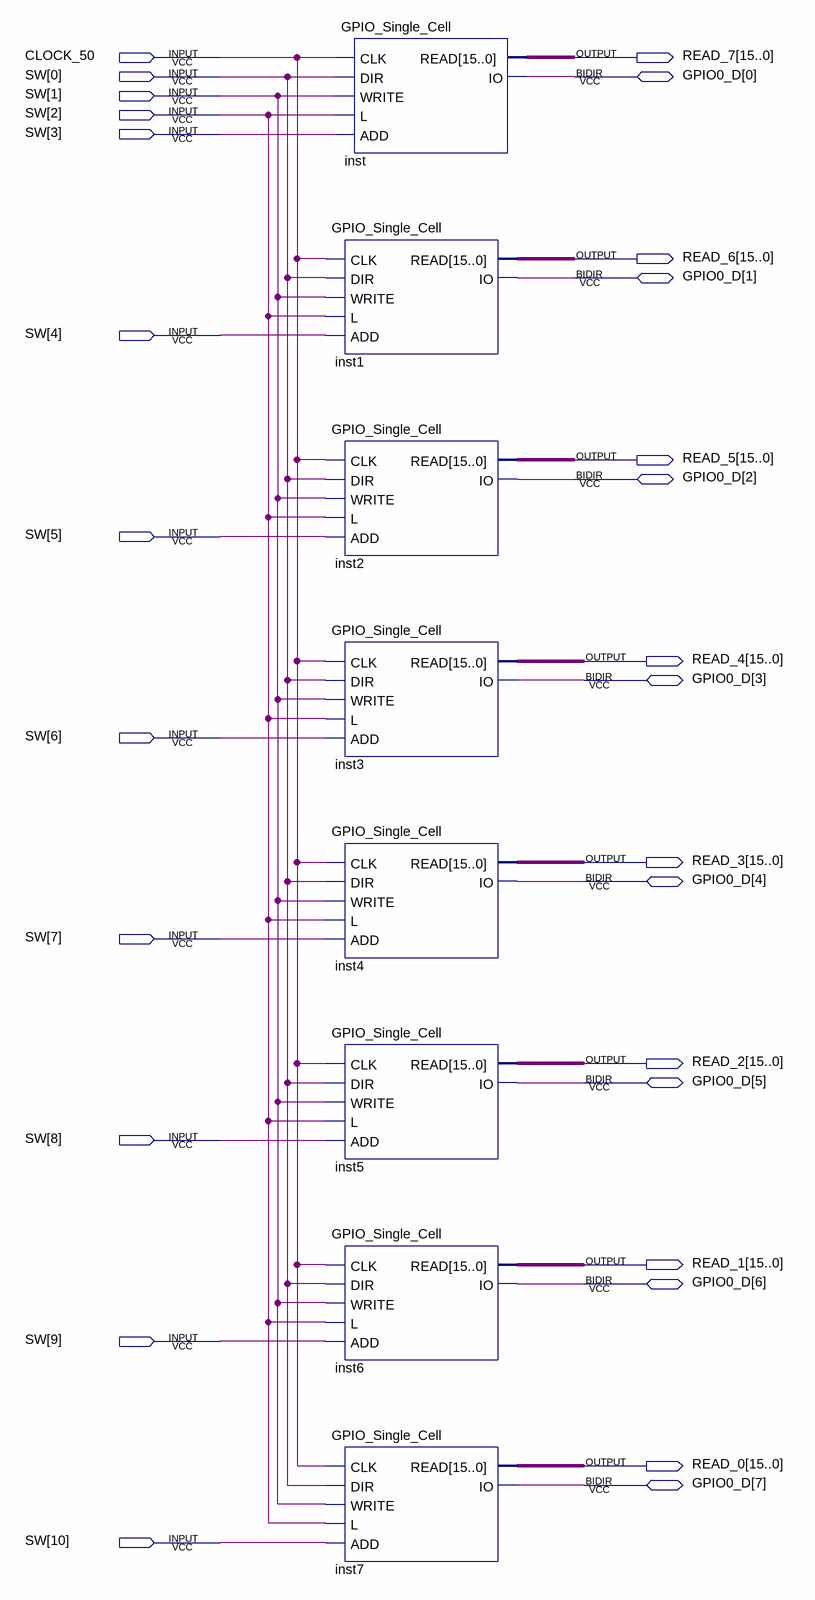
[diagram p0: schematic sheet]
// Quartus schematic GPIO_A_TEST.bdf as structural Verilog: 8 symbols, 28 pins
module GPIO_A_TEST (
  input  CLOCK_50,
  input  [10:0] SW,
  inout  [7:0] GPIO0_D,
  output [15:0] READ_7,
  output [15:0] READ_6,
  output [15:0] READ_5,
  output [15:0] READ_4,
  output [15:0] READ_3,
  output [15:0] READ_2,
  output [15:0] READ_1,
  output [15:0] READ_0
);

  GPIO_Single_Cell inst (
    .CLK(CLOCK_50), .DIR(SW[0]), .WRITE(SW[1]), .L(SW[2]), .ADD(SW[3]), .READ(READ_7), .IO(GPIO0_D[0]));
  GPIO_Single_Cell inst1 (
    .CLK(CLOCK_50), .DIR(SW[0]), .WRITE(SW[1]), .L(SW[2]), .ADD(SW[4]), .READ(READ_6), .IO(GPIO0_D[1]));
  GPIO_Single_Cell inst2 (
    .CLK(CLOCK_50), .DIR(SW[0]), .WRITE(SW[1]), .L(SW[2]), .ADD(SW[5]), .READ(READ_5), .IO(GPIO0_D[2]));
  GPIO_Single_Cell inst3 (
    .CLK(CLOCK_50), .DIR(SW[0]), .WRITE(SW[1]), .L(SW[2]), .ADD(SW[6]), .READ(READ_4), .IO(GPIO0_D[3]));
  GPIO_Single_Cell inst4 (
    .CLK(CLOCK_50), .DIR(SW[0]), .WRITE(SW[1]), .L(SW[2]), .ADD(SW[7]), .READ(READ_3), .IO(GPIO0_D[4]));
  GPIO_Single_Cell inst5 (
    .CLK(CLOCK_50), .DIR(SW[0]), .WRITE(SW[1]), .L(SW[2]), .ADD(SW[8]), .READ(READ_2), .IO(GPIO0_D[5]));
  GPIO_Single_Cell inst6 (
    .CLK(CLOCK_50), .DIR(SW[0]), .WRITE(SW[1]), .L(SW[2]), .ADD(SW[9]), .READ(READ_1), .IO(GPIO0_D[6]));
  GPIO_Single_Cell inst7 (
    .CLK(CLOCK_50), .DIR(SW[0]), .WRITE(SW[1]), .L(SW[2]), .ADD(SW[10]), .READ(READ_0), .IO(GPIO0_D[7]));
endmodule
